# EAGLE design computeModuleDaughterV2 (EAGLE 9.5.2)

## Sheet 1 of 3
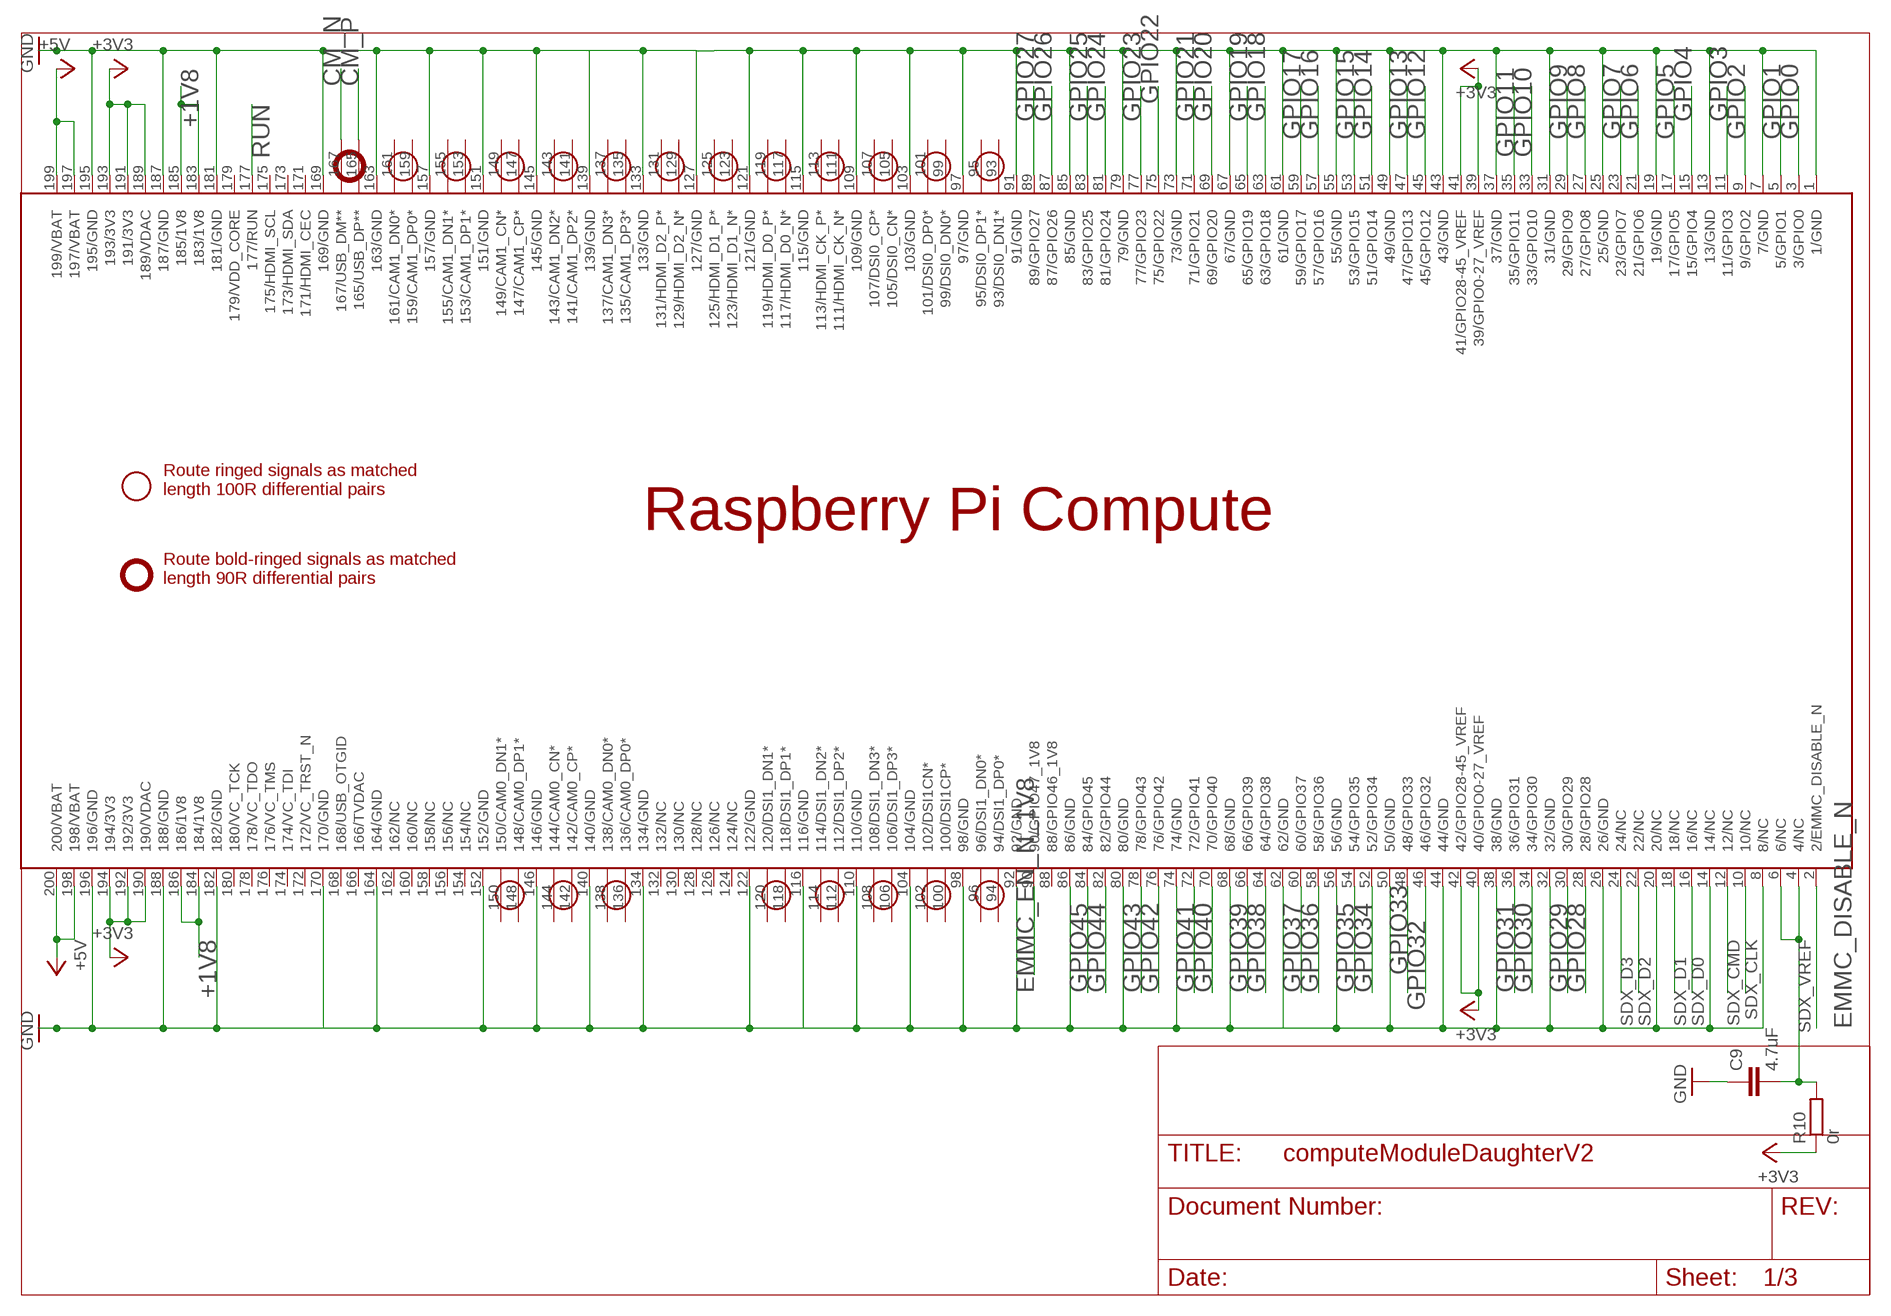
[diagram p0: schematic, sheet 1]

### Parts
C9  4.7uF  C-EUC0603  [C0603]
PCB1  RPI_COMPUTE  [RPI_COMPUTE]
R10  0r  R-EU_R0603  [R0603]

### Nets
+1V8: PCB1.183(183/1V8) PCB1.184(184/1V8) PCB1.185(185/1V8) PCB1.186(186/1V8) ; also sheet 3
+3V3: PCB1.39(39/GPIO0-27_VREF) PCB1.40(40/GPIO0-27_VREF) PCB1.41(41/GPIO28-45_VREF) PCB1.42(42/GPIO28-45_VREF) PCB1.189(189/VDAC) PCB1.190(190/VDAC) PCB1.191(191/3V3) PCB1.192(192/3V3) PCB1.193(193/3V3) PCB1.194(194/3V3) R10.1 ; also sheet 2,3
+5V: PCB1.197(197/VBAT) PCB1.198(198/VBAT) PCB1.199(199/VBAT) PCB1.200(200/VBAT) ; also sheet 2,3
CM_N [USB]: PCB1.167(167/USB_DM**) ; also sheet 3
CM_P [USB]: PCB1.165(165/USB_DP**) ; also sheet 3
EMMC_DISABLE_N: PCB1.2(2/EMMC_DISABLE_N) ; also sheet 3
EMMC_EN_N_1V8: PCB1.90(90/GPIO47_1V8) ; also sheet 3
GND: C9.1 PCB1.1(1/GND) PCB1.7(7/GND) PCB1.8(8/NC) PCB1.13(13/GND) PCB1.14(14/NC) PCB1.19(19/GND) PCB1.20(20/NC) PCB1.25(25/GND) PCB1.26(26/GND) PCB1.31(31/GND) PCB1.32(32/GND) PCB1.37(37/GND) PCB1.38(38/GND) PCB1.43(43/GND) PCB1.44(44/GND) PCB1.49(49/GND) PCB1.50(50/GND) PCB1.55(55/GND) PCB1.56(56/GND) PCB1.61(61/GND) PCB1.62(62/GND) PCB1.67(67/GND) PCB1.68(68/GND) PCB1.73(73/GND) PCB1.74(74/GND) PCB1.79(79/GND) PCB1.80(80/GND) PCB1.85(85/GND) PCB1.86(86/GND) PCB1.91(91/GND) PCB1.92(92/GND) PCB1.97(97/GND) PCB1.98(98/GND) PCB1.103(103/GND) PCB1.104(104/GND) PCB1.109(109/GND) PCB1.110(110/GND) PCB1.115(115/GND) PCB1.116(116/GND) PCB1.121(121/GND) PCB1.122(122/GND) PCB1.127(127/GND) PCB1.133(133/GND) PCB1.134(134/GND) PCB1.139(139/GND) PCB1.140(140/GND) PCB1.145(145/GND) PCB1.146(146/GND) PCB1.151(151/GND) PCB1.152(152/GND) PCB1.157(157/GND) PCB1.163(163/GND) PCB1.164(164/GND) PCB1.169(169/GND) PCB1.170(170/GND) PCB1.181(181/GND) PCB1.182(182/GND) PCB1.187(187/GND) PCB1.188(188/GND) PCB1.195(195/GND) PCB1.196(196/GND) ; also sheet 2,3
GPIO0: PCB1.3(3/GPIO0) ; also sheet 2
GPIO1: PCB1.5(5/GPIO1) ; also sheet 2
GPIO2: PCB1.9(9/GPIO2) ; also sheet 2
GPIO3: PCB1.11(11/GPIO3) ; also sheet 2
GPIO4: PCB1.15(15/GPIO4) ; also sheet 2
GPIO5: PCB1.17(17/GPIO5) ; also sheet 2
GPIO6: PCB1.21(21/GPIO6) ; also sheet 2
GPIO7: PCB1.23(23/GPIO7) ; also sheet 2
GPIO8: PCB1.27(27/GPIO8) ; also sheet 2
GPIO9: PCB1.29(29/GPIO9) ; also sheet 2
GPIO10: PCB1.33(33/GPIO10) ; also sheet 2
GPIO11: PCB1.35(35/GPIO11) ; also sheet 2
GPIO12: PCB1.45(45/GPIO12) ; also sheet 2
GPIO13: PCB1.47(47/GPIO13) ; also sheet 2
GPIO14: PCB1.51(51/GPIO14) ; also sheet 2
GPIO15: PCB1.53(53/GPIO15) ; also sheet 2
GPIO16: PCB1.57(57/GPIO16) ; also sheet 2
GPIO17: PCB1.59(59/GPIO17) ; also sheet 2
GPIO18: PCB1.63(63/GPIO18) ; also sheet 2
GPIO19: PCB1.65(65/GPIO19) ; also sheet 2
GPIO20: PCB1.69(69/GPIO20) ; also sheet 2
GPIO21: PCB1.71(71/GPIO21) ; also sheet 2
GPIO22: PCB1.75(75/GPIO22) ; also sheet 2
GPIO23: PCB1.77(77/GPIO23) ; also sheet 2
GPIO24: PCB1.81(81/GPIO24) ; also sheet 2
GPIO25: PCB1.83(83/GPIO25) ; also sheet 2
GPIO26: PCB1.87(87/GPIO26) ; also sheet 2
GPIO27: PCB1.89(89/GPIO27) ; also sheet 2
GPIO28: PCB1.28(28/GPIO28) ; also sheet 2
GPIO29: PCB1.30(30/GPIO29) ; also sheet 2
GPIO30: PCB1.34(34/GPIO30) ; also sheet 2
GPIO31: PCB1.36(36/GPIO31) ; also sheet 2
GPIO32: PCB1.46(46/GPIO32) ; also sheet 2
GPIO33: PCB1.48(48/GPIO33) ; also sheet 2
GPIO34: PCB1.52(52/GPIO34) ; also sheet 2
GPIO35: PCB1.54(54/GPIO35) ; also sheet 2
GPIO36: PCB1.58(58/GPIO36) ; also sheet 2
GPIO37: PCB1.60(60/GPIO37) ; also sheet 2
GPIO38: PCB1.64(64/GPIO38) ; also sheet 2
GPIO39: PCB1.66(66/GPIO39) ; also sheet 2
GPIO40: PCB1.70(70/GPIO40) ; also sheet 2
GPIO41: PCB1.72(72/GPIO41) ; also sheet 2
GPIO42: PCB1.76(76/GPIO42) ; also sheet 2
GPIO43: PCB1.78(78/GPIO43) ; also sheet 2
GPIO44: PCB1.82(82/GPIO44) ; also sheet 2
GPIO45: PCB1.84(84/GPIO45) ; also sheet 2
RUN: PCB1.177(177/RUN) ; also sheet 2
SDX_CLK: PCB1.10(10/NC) ; also sheet 2
SDX_CMD: PCB1.12(12/NC) ; also sheet 2
SDX_D0: PCB1.16(16/NC) ; also sheet 2
SDX_D1: PCB1.18(18/NC) ; also sheet 2
SDX_D2: PCB1.22(22/NC) ; also sheet 2
SDX_D3: PCB1.24(24/NC) ; also sheet 2
SDX_VREF: C9.2 PCB1.4(4/NC) PCB1.6(6/NC) R10.2
Unconnected: PCB1.88(88/GPIO46_1V8) PCB1.93(93/DSI0_DN1*) PCB1.94(94/DSI1_DP0*) PCB1.95(95/DSI0_DP1*) PCB1.96(96/DSI1_DN0*) PCB1.99(99/DSI0_DN0*) PCB1.100(100/DSI1CP*) PCB1.101(101/DSI0_DP0*) PCB1.102(102/DSI1CN*) PCB1.105(105/DSI0_CN*) PCB1.106(106/DSI1_DP3*) PCB1.107(107/DSI0_CP*) PCB1.108(108/DSI1_DN3*) PCB1.111(111/HDMI_CK_N*) PCB1.112(112/DSI1_DP2*) PCB1.113(113/HDMI_CK_P*) PCB1.114(114/DSI1_DN2*) PCB1.117(117/HDMI_D0_N*) PCB1.118(118/DSI1_DP1*) PCB1.119(119/HDMI_D0_P*) PCB1.120(120/DSI1_DN1*) PCB1.123(123/HDMI_D1_N*) PCB1.124(124/NC) PCB1.125(125/HDMI_D1_P*) PCB1.126(126/NC) PCB1.128(128/NC) PCB1.129(129/HDMI_D2_N*) PCB1.130(130/NC) PCB1.131(131/HDMI_D2_P*) PCB1.132(132/NC) PCB1.135(135/CAM1_DP3*) PCB1.136(136/CAM0_DP0*) PCB1.137(137/CAM1_DN3*) PCB1.138(138/CAM0_DN0*) PCB1.141(141/CAM1_DP2*) PCB1.142(142/CAM0_CP*) PCB1.143(143/CAM1_DN2*) PCB1.144(144/CAM0_CN*) PCB1.147(147/CAM1_CP*) PCB1.148(148/CAM0_DP1*) PCB1.149(149/CAM1_CN*) PCB1.150(150/CAM0_DN1*) PCB1.153(153/CAM1_DP1*) PCB1.154(154/NC) PCB1.155(155/CAM1_DN1*) PCB1.156(156/NC) PCB1.158(158/NC) PCB1.159(159/CAM1_DP0*) PCB1.160(160/NC) PCB1.161(161/CAM1_DN0*) PCB1.162(162/NC) PCB1.166(166/TVDAC) PCB1.168(168/USB_OTGID) PCB1.171(171/HDMI_CEC) PCB1.172(172/VC_TRST_N) PCB1.173(173/HDMI_SDA) PCB1.174(174/VC_TDI) PCB1.175(175/HDMI_SCL) PCB1.176(176/VC_TMS) PCB1.178(178/VC_TDO) PCB1.179(179/VDD_CORE) PCB1.180(180/VC_TCK)

## Sheet 2 of 3
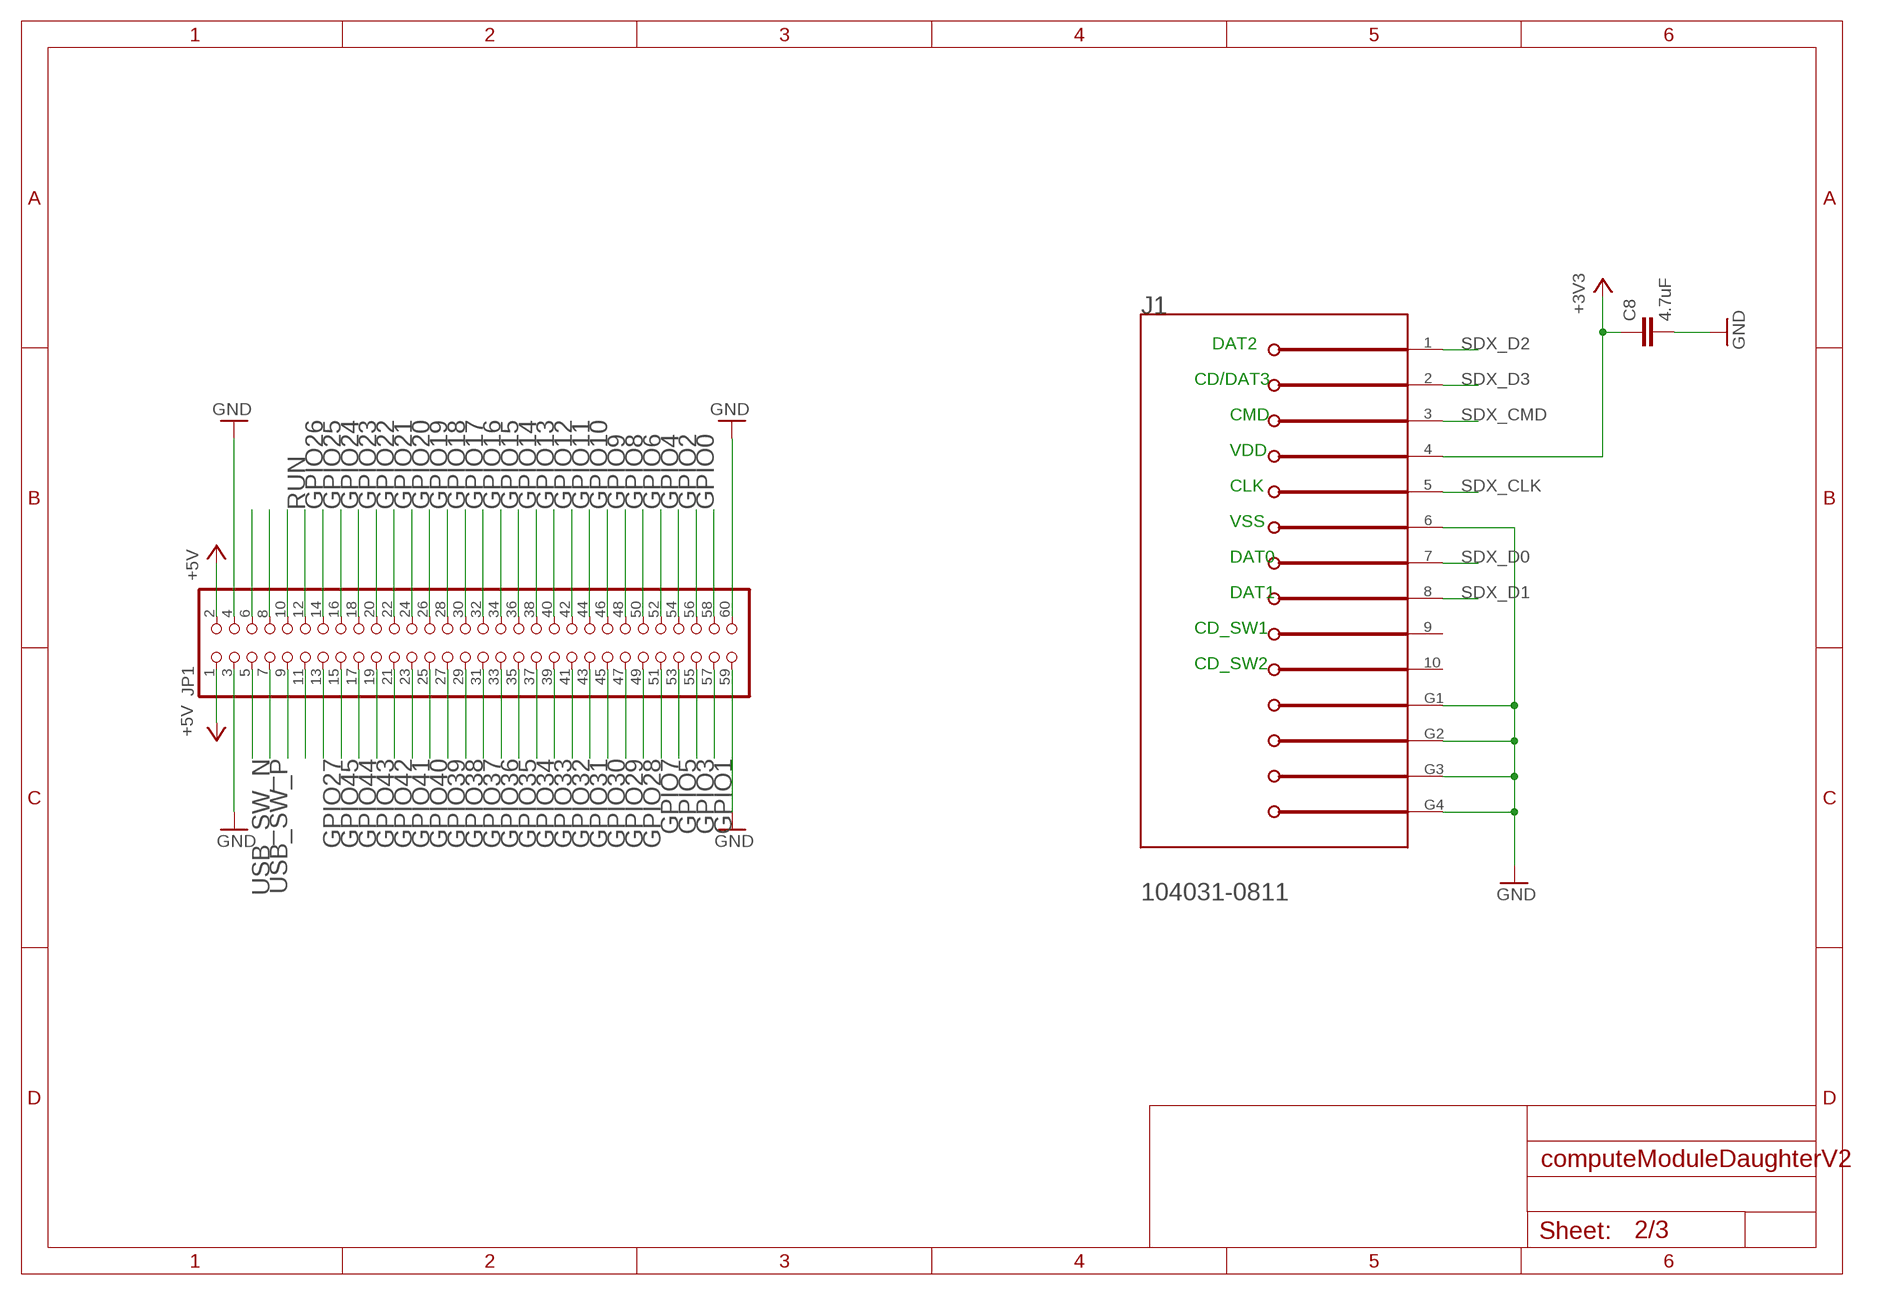
[diagram p1: schematic, sheet 2]

### Parts
C8  4.7uF  C-EUC0603  [C0603]
J1  MOLEX_104031-0811MOLEX_104031-0811_0_0  [MOLEX_104031-0811_0]
JP1  PINHD-2X30  [2X30]

### Nets
+3V3: C8.1 J1.4(VDD) ; also sheet 1,3
+5V: JP1.1 JP1.2 ; also sheet 1,3
GND: C8.2 J1.6(VSS) J1.G1 J1.G2 J1.G3 J1.G4 JP1.3 JP1.4 JP1.59 JP1.60 ; also sheet 1,3
GPIO0: JP1.58 ; also sheet 1
GPIO1: JP1.57 ; also sheet 1
GPIO2: JP1.56 ; also sheet 1
GPIO3: JP1.55 ; also sheet 1
GPIO4: JP1.54 ; also sheet 1
GPIO5: JP1.53 ; also sheet 1
GPIO6: JP1.52 ; also sheet 1
GPIO7: JP1.51 ; also sheet 1
GPIO8: JP1.50 ; also sheet 1
GPIO9: JP1.48 ; also sheet 1
GPIO10: JP1.46 ; also sheet 1
GPIO11: JP1.44 ; also sheet 1
GPIO12: JP1.42 ; also sheet 1
GPIO13: JP1.40 ; also sheet 1
GPIO14: JP1.38 ; also sheet 1
GPIO15: JP1.36 ; also sheet 1
GPIO16: JP1.34 ; also sheet 1
GPIO17: JP1.32 ; also sheet 1
GPIO18: JP1.30 ; also sheet 1
GPIO19: JP1.28 ; also sheet 1
GPIO20: JP1.26 ; also sheet 1
GPIO21: JP1.24 ; also sheet 1
GPIO22: JP1.22 ; also sheet 1
GPIO23: JP1.20 ; also sheet 1
GPIO24: JP1.18 ; also sheet 1
GPIO25: JP1.16 ; also sheet 1
GPIO26: JP1.14 ; also sheet 1
GPIO27: JP1.13 ; also sheet 1
GPIO28: JP1.49 ; also sheet 1
GPIO29: JP1.47 ; also sheet 1
GPIO30: JP1.45 ; also sheet 1
GPIO31: JP1.43 ; also sheet 1
GPIO32: JP1.41 ; also sheet 1
GPIO33: JP1.39 ; also sheet 1
GPIO34: JP1.37 ; also sheet 1
GPIO35: JP1.35 ; also sheet 1
GPIO36: JP1.33 ; also sheet 1
GPIO37: JP1.31 ; also sheet 1
GPIO38: JP1.29 ; also sheet 1
GPIO39: JP1.27 ; also sheet 1
GPIO40: JP1.25 ; also sheet 1
GPIO41: JP1.23 ; also sheet 1
GPIO42: JP1.21 ; also sheet 1
GPIO43: JP1.19 ; also sheet 1
GPIO44: JP1.17 ; also sheet 1
GPIO45: JP1.15 ; also sheet 1
N$77: JP1.10
N$78: JP1.8
N$79: JP1.6
N$82: JP1.9
N$83: JP1.11
RUN: JP1.12 ; also sheet 1
SDX_CLK: J1.5(CLK) ; also sheet 1
SDX_CMD: J1.3(CMD) ; also sheet 1
SDX_D0: J1.7(DAT0) ; also sheet 1
SDX_D1: J1.8(DAT1) ; also sheet 1
SDX_D2: J1.1(DAT2) ; also sheet 1
SDX_D3: J1.2(CD/DAT3) ; also sheet 1
USB_SW_N [USB]: JP1.5 ; also sheet 3
USB_SW_P [USB]: JP1.7 ; also sheet 3
Unconnected: J1.9(1_CARD_DETECT_SWITCH) J1.10(2_CARD_DETECT_SWITCH)

### Notes on the sheet
- DAT2
- CD/DAT3
- CMD
- VDD
- CLK
- VSS
- DAT0
- DAT1
- CD_SW1
- CD_SW2

## Sheet 3 of 3
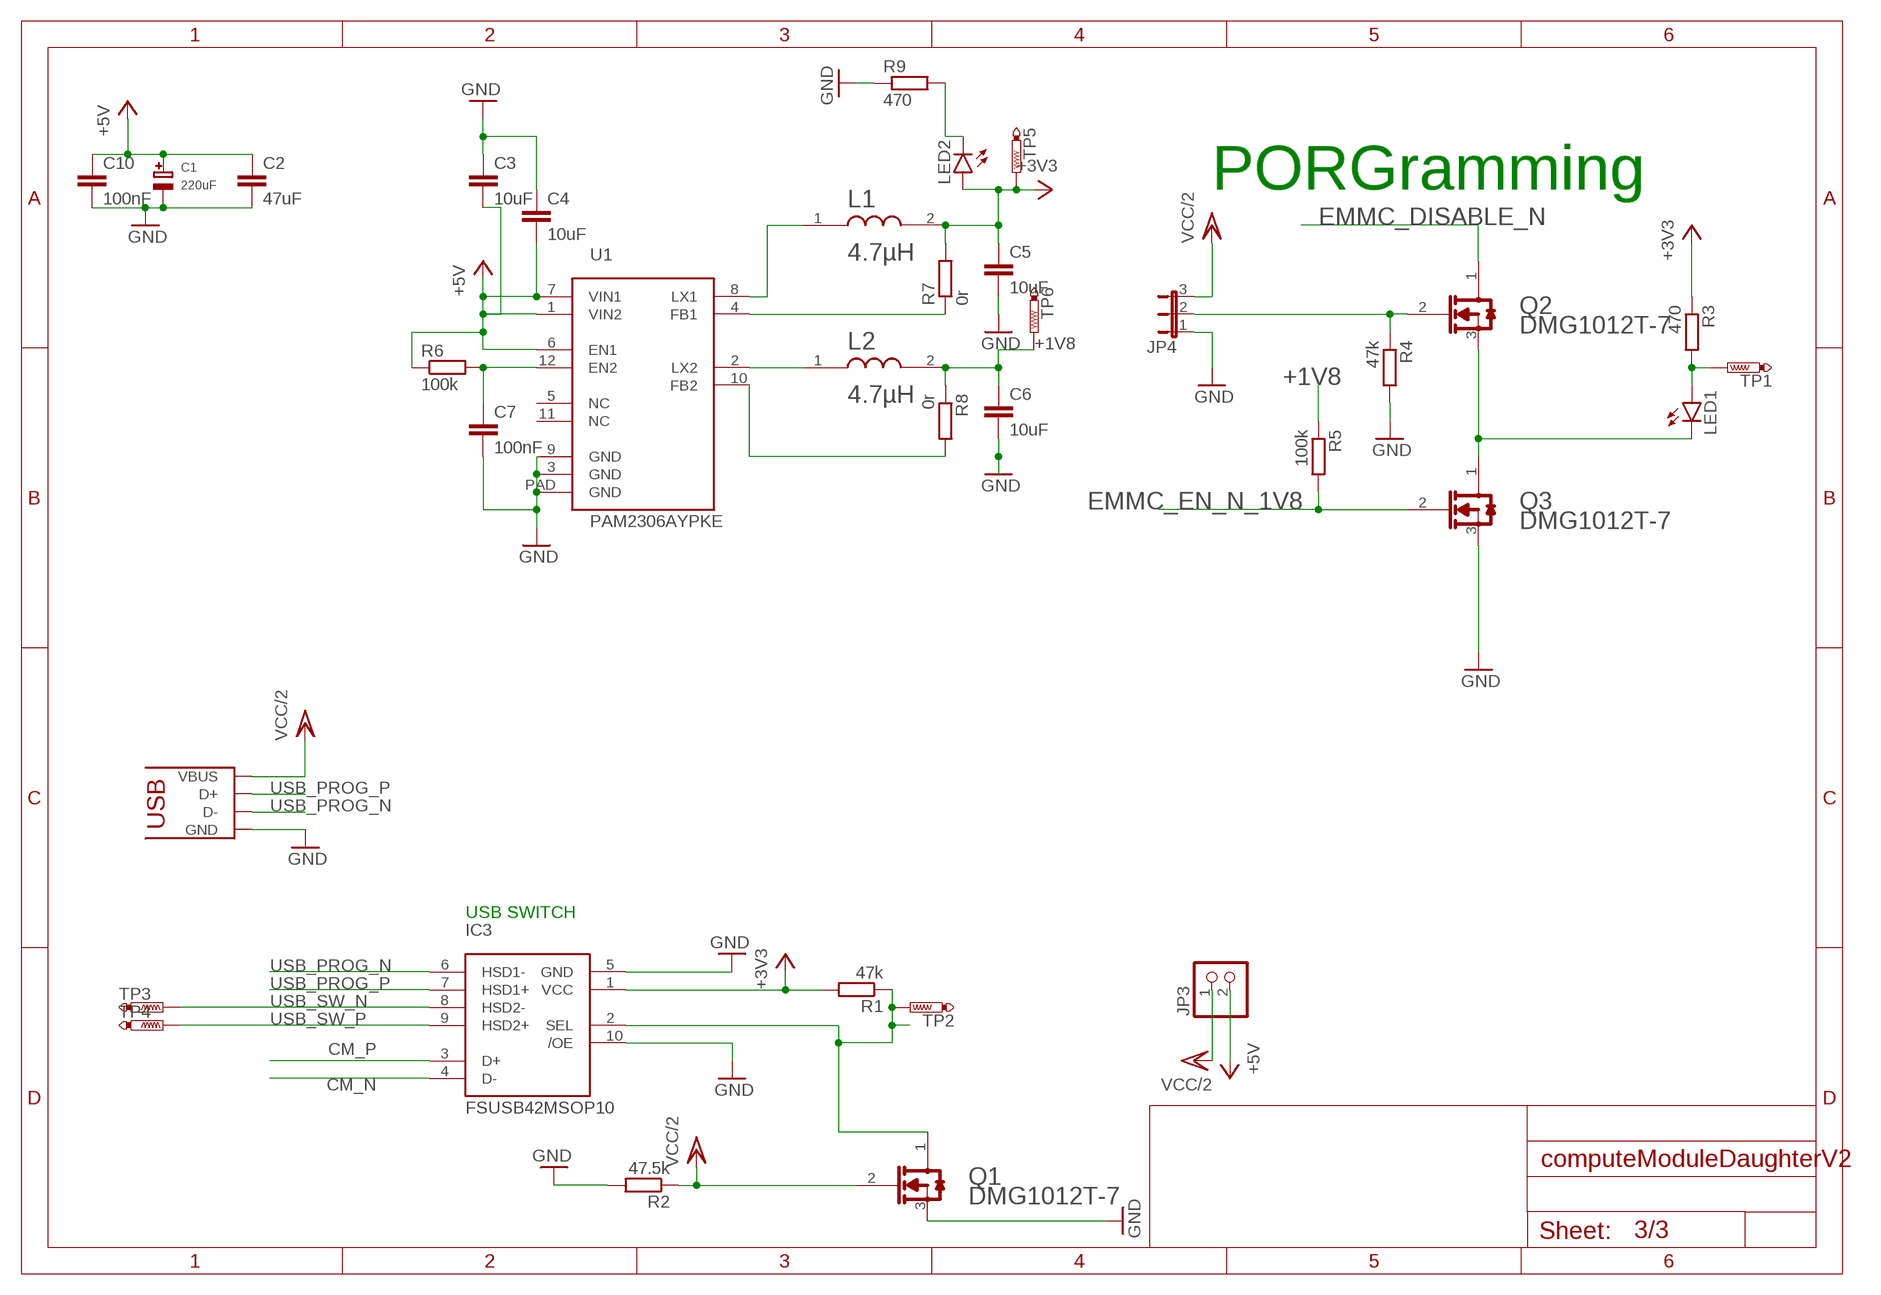
[diagram p2: schematic, sheet 3]

### Parts
C1  220uF  CAP_ELECTROLYTICPANASONIC_D  [PANASONIC_D]
C2  47uF  C-EUC1206  [C1206]
C3  10uF  C-EUC0805  [C0805]
C4  10uF  C-EUC0805  [C0805]
C5  10uF  C-EUC0805  [C0805]
C6  10uF  C-EUC0805  [C0805]
C7  100nF  C-EUC0603  [C0603]
C10  100nF  C-EUC0603  [C0603]
IC3  FSUSB42MSOP10  [MSOP10]
JP2  USB-MICROB  [USB-MICROB]
JP3  PINHD-1X2  [1X02]
JP4  JP2E  [JP2]
L1  BOURNS_SRN4018-4R7MBOURNS_SRN4018-4R7M_0_0  [BOURNS_SRN4018-4R7M_0]
L2  BOURNS_SRN4018-4R7MBOURNS_SRN4018-4R7M_0_0  [BOURNS_SRN4018-4R7M_0]
LED1  LEDCHIP-LED0603  [CHIP-LED0603]
LED2  LEDCHIP-LED0603  [CHIP-LED0603]
Q1  DIODES_DMG1012T-7DIODES_DMG1012T-7_0_0  [DIODES_DMG1012T-7_0]
Q2  DIODES_DMG1012T-7DIODES_DMG1012T-7_0_0  [DIODES_DMG1012T-7_0]
Q3  DIODES_DMG1012T-7DIODES_DMG1012T-7_0_0  [DIODES_DMG1012T-7_0]
R1  47k  R-EU_R0603  [R0603]
R2  47.5k  R-EU_R0603  [R0603]
R3  470  R-EU_R0603  [R0603]
R4  47k  R-EU_R0603  [R0603]
R5  100k  R-EU_R0603  [R0603]
R6  100k  R-EU_R0603  [R0603]
R7  0r  R-EU_R0603  [R0603]
R8  0r  R-EU_R0603  [R0603]
R9  470  R-EU_R0603  [R0603]
TP1  PTR1B1,27  [B1,27]
TP2  PTR1B1,27  [B1,27]
TP3  PTR1B1,27  [B1,27]
TP4  PTR1B1,27  [B1,27]
TP5  PTR1B1,27  [B1,27]
TP6  PTR1B1,27  [B1,27]
U1  PAM2306AYPKE  [WDFN-12L]

### Nets
+1V8: C6.1 L2.2 R5.1 R8.1 TP6.TP ; also sheet 1
+3V3: C5.1 IC3.1(VCC) L1.2 LED2.A R1.2 R3.1 R7.2 TP5.TP ; also sheet 1,2
+5V: C1.+ C2.1 C3.2 C4.2 C10.1 JP3.2 R6.1 U1.1(VIN2) U1.6(EN1) U1.7(VIN1) ; also sheet 1,2
CM_N [USB]: IC3.4(D-) ; also sheet 1
CM_P [USB]: IC3.3(D+) ; also sheet 1
EMMC_DISABLE_N: Q2.1(DRAIN) ; also sheet 1
EMMC_EN_N_1V8: Q3.2(GATE) R5.2 ; also sheet 1
GND: C1.- C2.2 C3.1 C4.1 C5.2 C6.2 C7.2 C10.2 IC3.5(GND) IC3.10(/OE) JP2.GND JP2.MT1(GND) JP2.MT2(GND) JP2.P$1(GND) JP2.P$2(GND) JP2.P$3(GND) JP2.P$4(GND) JP4.1 Q1.3(SOURCE) Q3.3(SOURCE) R2.2 R4.2 R9.1 U1.3(GND) U1.9(GND) U1.PAD(GND) ; also sheet 1,2
N$1: L1.1 U1.8(LX1)
N$2: JP4.2 Q2.2(GATE) R4.1
N$3: C7.1 R6.2 U1.12(EN2)
N$4: LED1.C Q2.3(SOURCE) Q3.1(DRAIN)
N$5: LED1.A R3.2 TP1.TP
N$6: L2.1 U1.2(LX2)
N$7: R7.1 U1.4(FB1)
N$8: IC3.2(SEL) Q1.1(DRAIN) R1.1 TP2.TP
N$9: LED2.C R9.2
N$11: R8.2 U1.10(FB2)
USB_PROG_N [USB]: IC3.6(HSD1-) JP2.D-
USB_PROG_P [USB]: IC3.7(HSD1+) JP2.D+
USB_SW_N [USB]: IC3.8(HSD2-) TP3.TP ; also sheet 2
USB_SW_P [USB]: IC3.9(HSD2+) TP4.TP ; also sheet 2
VCC/2: JP2.VBUS JP3.1 JP4.3 Q1.2(GATE) R2.1
Unconnected: U1.5(NC) U1.11(NC)

### Notes on the sheet
- PORGramming
- USB SWITCH

## Library data of the parts
C1 = microbuilder:CAP_ELECTROLYTIC: Electrolytic Capacitors SMT PANASONIC_C - Size C Panasonic Electrolytic Aluminum Capacitor 47µF 16V 20% Electrolytic Capacitor [Digikey: PCE3890TR-ND] PANASONIC_D - Size D Panasonic Electrolytic Aluminum Capacitor 100µF 25V 20% Electrolytic Capacitor [Digikey: PCE3898TR-ND] PTH 3.5 mm grid, 8 mm diameter ... 3.5 mm grid, 10 mm diameter ...
C2-C10 = resistor:C-EU: CAPACITOR, European symbol
IC3 = raspberrypi_cm:FSUSB42: FSUSB42 www.hasseb.fi
J1 = Molex - 104031-0811:MOLEX_104031-0811: 1.10mm Pitch microSD* Memory Card Connector, Surface Mount, Push-Pull Type, 1.42mm Height, with Detect Switch; CENTROID_NOT_SPECIFIED: No; CONN_GENDER: Female; CONN_ORIENTATION: Horizontal; CONTACT_MATERIAL: Gold; CURRENT_RATING: 0.5A; DATASHEET: http://www.molex.com/pdm_docs/sd/1040310811_sd.pdf; DEVICE_CLASS_L1: Connectors; DEVICE_CLASS_L2: Card Edge Connectors; DEVICE_CLASS_L3: unset; DIGIKEY_DESCRIPTION: CONN MICRO SD CARD PUSH-PULL R/A; DIGIKEY_PART_NUMBER: WM6357CT-ND; FOOTPRINT_URL: https://www.molex.com/pdm_docs/sd/1040310811_sd.pdf; HEIGHT: 1.57mm; IS_FEMALE: yes; LEAD_FREE: yes; MF: Molex; MFG_PACKAGE_IDENT: 104031-0811; MFG_PACKAGE_IDENT_DATE: 0; MFG_PACKAGE_IDENT_REV: 0; MOUSER_DESCRIPTION: 1.10mm Pitch microSD Memory Card Connector, SMT, Push-Pull Type, 1.42mm Height, with Detect Switch; MOUSER_PART_NUMBER: WM6357CT-ND; MPN: 104031-0811; NUMBER_OF_CONTACTS: 8; NUMBER_OF_ROWS: 1; PACKAGE: SMT_MICROSD_SOCKET; PREFIX: J; ROHS: yes; TEMPERATURE_RANGE_HIGH: +85°C; TEMPERATURE_RANGE_LOW: -25°C; VOLTAGE_RATING: 10mV
JP1 = pinhead:PINHD-2X30: PIN HEADER
JP2 = pimoroni:USB-MICROB
JP3 = pinhead:PINHD-1X2: PIN HEADER
JP4 = jumper:JP2E: JUMPER
L1 L2 = Bourns - SRN4018-4R7M:BOURNS_SRN4018-4R7M: Fixed Inductors 4.7uH 20% SMD 4018; CENTROID_NOT_SPECIFIED: No; DATASHEET: http://www.bourns.com/docs/Product-Datasheets/SRN4018.pdf; DCR_MAX: 0.084 Ohm; DIGIKEY_DESCRIPTION: IND 4.7µH Shielded Wirewound Inductor 1.9A 84 mOhm Max Nonstandard; DIGIKEY_PART_NUMBER: SRN4018-4R7MCT-ND; IMPORTED_FROM: octopart; INDUCTANCE: 4.7µH; IRMS: 1.9A; ISAT: 2A; LEAD_FREE: yes; MF: Bourns; MOUSER_PART_NUMBER: 652-SRN4018-4R7M; MPN: SRN4018-4R7M; NUM_PINS: 2; OCTOPART_PART_NUMBER: ed5a25d49750329d; PACKAGE: IND_SMD_4MM0_4MM0; PREFIX: L; ROHS: yes; TEMPERATURE_RANGE_HIGH: +120°C; TEMPERATURE_RANGE_LOW: -25°C; TOL.: 20%
LED1 LED2 = led:LED: LED OSRAM: - CHIPLED LG R971, LG N971, LY N971, LG Q971, LY Q971, LO R971, LY R971 LH N974, LH R974 LS Q976, LO Q976, LY Q976 LO Q996 - Hyper CHIPLED LW Q18S LB Q993, LB Q99A, LB R99A - SideLED LS A670, LO A670, LY A670, LG A670, LP A670 LB A673, LV A673, LT A673, LW A673 LH A674 LY A675 LS A676, LA A676, LO A676, LY A676, LW A676 LS A679, LY A679, LG A679 - Hyper Micro SIDELED® LS Y876, LA Y876, LO Y876, LY Y876 LT Y87S - SmartLED LW L88C, LW L88S LB L89C, LB L89S, LG L890 LS L89K, LO L89K, LY L89K LS L896, LA L896, LO L896, LY L896 - TOPLED LS T670, LO T670, LY T670, LG T670, LP T670 LSG T670, LSP T670, LSY T670, LOP T670, LYG T670 LG T671, LOG T671, LSG T671 LB T673, LV T673, LT T673, LW T673 LH T674 LS T676, LA T676, LO T676, LY T676, LB T676, LH T676, LSB T676, LW T676 LB T67C, LV T67C, LT T67C, LS T67K, LO T67K, LY T67K, LW E67C LS E67B, LA E67B, LO E67B, LY E67B, LB E67C, LV E67C, LT E67C LW T67C LS T679, LY T679, LG T679 LS T770, LO T770, LY T770, LG T770, LP T770 LB T773, LV T773, LT T773, LW T773 LH T774 LS E675, LA E675, LY E675, LS T675 LS T776, LA T776, LO T776, LY T776, LB T776 LHGB T686 LT T68C, LB T68C - Hyper Mini TOPLED® LB M676 - Mini TOPLED Santana® LG M470 LS M47K, LO M47K, LY M47K Source: http://www.osram.convergy.de LUXEON: - LUMILED® LXK2-PW12-R00, LXK2-PW12-S00, LXK2-PW14-U00, LXK2-PW14-V00 LXK2-PM12-R00, LXK2-PM12-S00, LXK2-PM14-U00 LXK2-PE12-Q00, LXK2-PE12-R00, LXK2-PE12-S00, LXK2-PE14-T00, LXK2-PE14-U00 LXK2-PB12-K00, LXK2-PB12-L00, LXK2-PB12-M00, LXK2-PB14-N00, LXK2-PB14-P00, LXK2-PB14-Q00 LXK2-PR12-L00, LXK2-PR12-M00, LXK2-PR14-Q00, LXK2-PR14-R00 LXK2-PD12-Q00, LXK2-PD12-R00, LXK2-PD12-S00 LXK2-PH12-R00, LXK2-PH12-S00 LXK2-PL12-P00, LXK2-PL12-Q00, LXK2-PL12-R00 Source: www.luxeon.com KINGBRIGHT: KA-3528ASYC Source: www.kingbright.com
PCB1 = e14_Rpi_Compute_RevC:RPI_COMPUTE: Device for a Raspberry PI Compute module. Note that the package is for a DDR2 connector of 'standard' orientation. Example: TE Connectivity P/N: 1565917-4, Newark P/N: 08P0616, Farnell P/N: 2112525 More information is available at http://www.element14.com/community/community/raspberry-pi/raspberry-pi-compute-module
Q1-Q3 = Diodes - DMG1012T-7:DIODES_DMG1012T-7: N-CHANNEL ENHANCEMENT MODE MOSFET; CENTROID_NOT_SPECIFIED: No; DATASHEET: https://www.diodes.com/assets/Datasheets/ds31783.pdf; DIGIKEY_DESCRIPTION: TRANS MOSFET N-CH 20V 630MA SOT-523; DIGIKEY_PART_NUMBER: DMG1012T-7DICT-ND; LEAD_FREE: yes; MF: Diodes; MOUSER_PART_NUMBER: 621-DMG1012T-7; MPN: DMG1012T-7; PACKAGE: SOT523; PREFIX: Q; ROHS: yes; TEMPERATURE_RANGE_HIGH: +150°C; TEMPERATURE_RANGE_LOW: -55°C
R1-R10 = resistor:R-EU_: RESISTOR, European symbol
TP1-TP6 = testpad:PTR1: TEST PIN
U1 = pimoroni-ics:PAM2306AYPKE

## Net classes
1 USB: width 0.178 mm

## Board
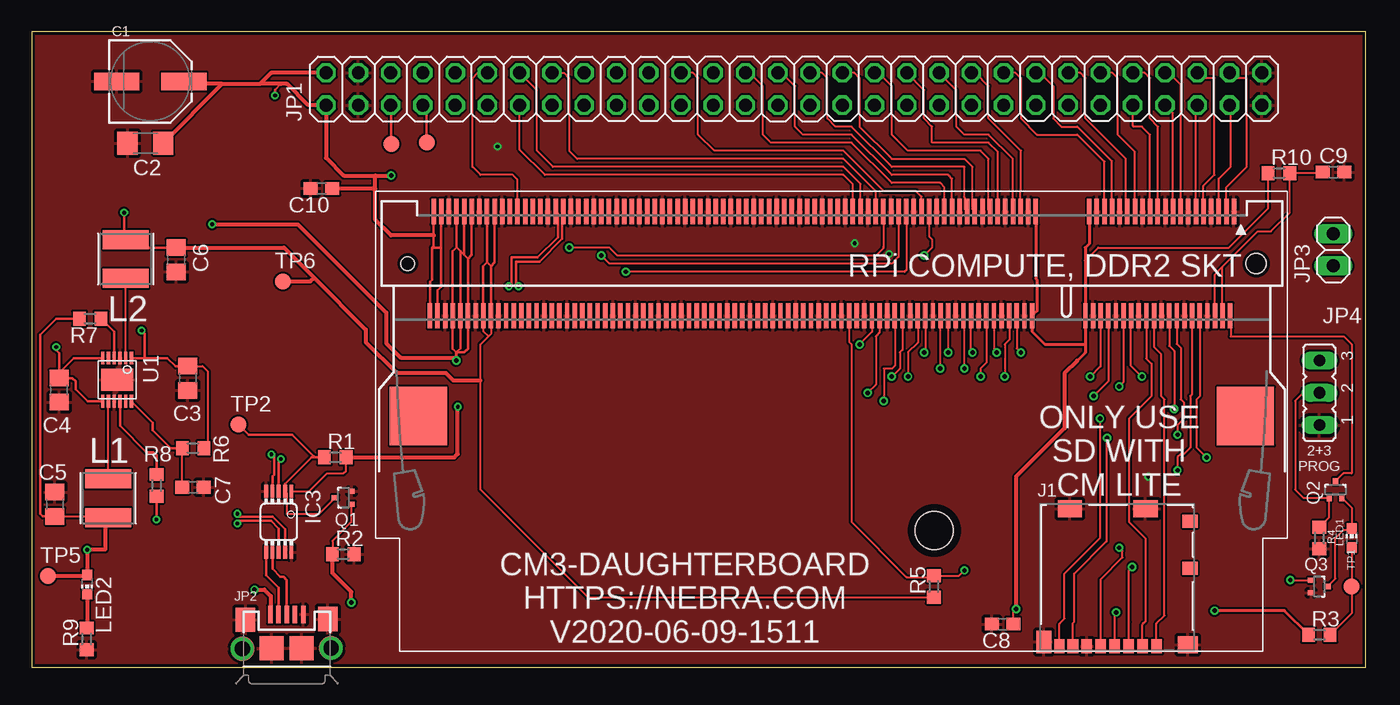
[diagram p3: board, top side]
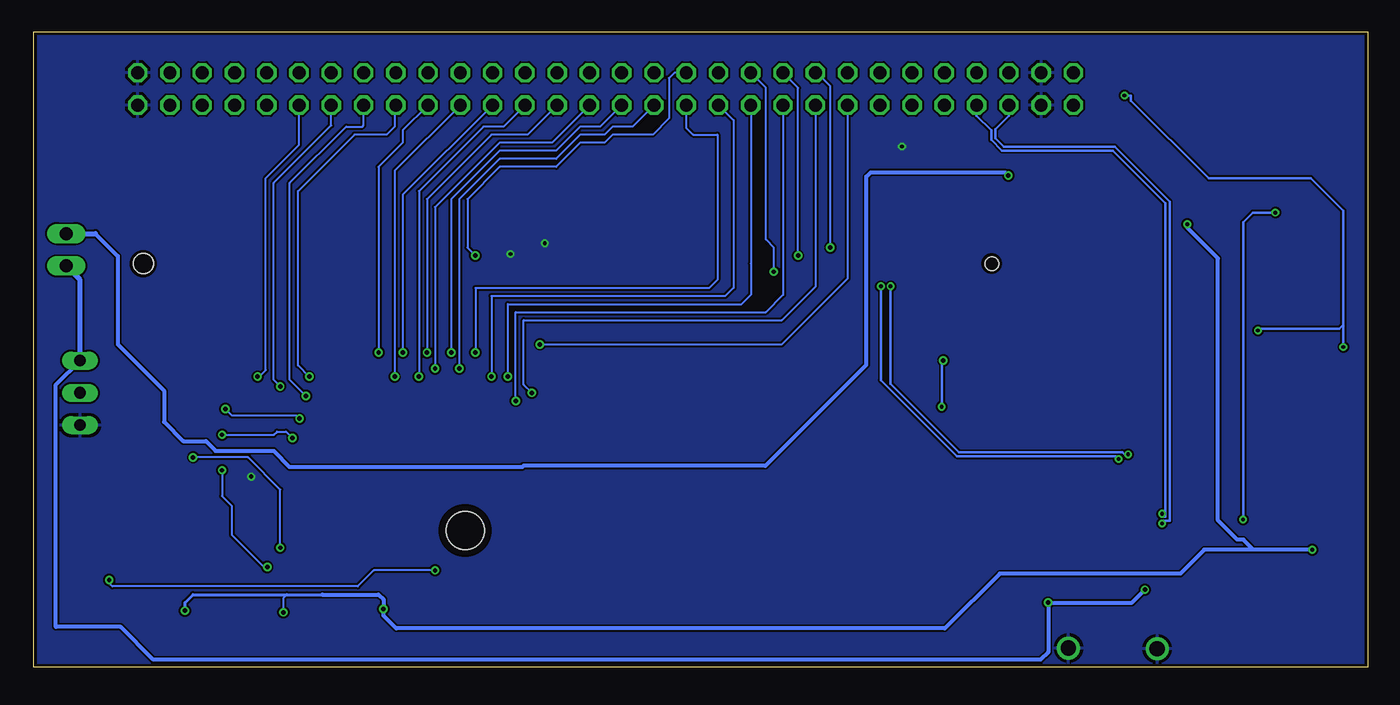
[diagram p4: board, bottom side, seen from below]

Size 105 x 50 mm. Coordinates in mm from the lower left corner, seen from the top.
Outline: 0,0 105,0 105,50 0,50 0,0
Copper layers (1*16): Top 0.035mm / dielectric 1.5mm / Bottom 0.035mm
Design rules "dirt_cheap_dirty_boards.v1.1": minimum track width 6mil, minimum drill 12mil, track to track 6mil, track to pad 6mil, pad to pad 6mil, via to via 6mil, smd to smd 0mil, copper to edge 10mil, drill to drill 10mil, minimum pad ring 10mil, minimum via ring 6mil, stop-mask expansion 2mil, vias tented up to drill 25mil, thermal gap 10mil
Holes 3 mm at 71.04,10.75
tRestrict: area 69,8.7 to 73.1,12.8
bRestrict: area 69,8.7 to 73.1,12.8

### Footprints (pad centres in the part's own frame; a part is rotated, then mirrored left to right if it is on the bottom)
PANASONIC_D = smd 3.556 x 1.4: + 2.654,0; - -2.654,0
C1206 = smd 1.6 x 1.8: 1 -1.4,0; 2 1.4,0
C0805 = smd 1.3 x 1.5: 1 -0.95,0; 2 0.95,0
C0603 = smd 1.1 x 1: 1 -0.85,0; 2 0.85,0
MSOP10 = smd 0.3 x 1.02: 1 -1,-2.4; 2 -0.5,-2.4; 3 0,-2.4; 4 0.5,-2.4; 5 1,-2.4; 6 1,2.4; 7 0.5,2.4; 8 0,2.4; 9 -0.5,2.4; 10 -1,2.4
MOLEX_104031-0811_0 = smd 0.85 x 1.1: 1 3.105,-5.45; 2 2.005,-5.45; 3 0.905,-5.45; 4 -0.195,-5.45; 5 -1.295,-5.45; 6 -2.395,-5.45; 7 -3.495,-5.45 | smd 0.75 x 1.1: 8 -4.545,-5.45 | smd 1.2 x 1: 9 5.74,4.4; 10 5.74,0.7 | smd 1.55 x 1.35: G1 5.565,-5.325 | smd 1.17 x 1.8: G2 -5.755,-5.1 | smd 1.9 x 1.35: G3 -3.73,5.375; G4 2.24,5.375
2X30 = drill 1.016 octagon: 1 -38.1,-1.27; 2 -38.1,1.27; 3 -35.56,-1.27; 4 -35.56,1.27; 5 -33.02,-1.27; 6 -33.02,1.27; 7 -30.48,-1.27; 8 -30.48,1.27; 9 -27.94,-1.27; 10 -27.94,1.27; 11 -25.4,-1.27; 12 -25.4,1.27; 13 -22.86,-1.27; 14 -22.86,1.27; 15 -20.32,-1.27; 16 -20.32,1.27; 17 -17.78,-1.27; 18 -17.78,1.27; 19 -15.24,-1.27; 20 -15.24,1.27; 21 -12.7,-1.27; 22 -12.7,1.27; 23 -10.16,-1.27; 24 -10.16,1.27; 25 -7.62,-1.27; 26 -7.62,1.27; 27 -5.08,-1.27; 28 -5.08,1.27; 29 -2.54,-1.27; 30 -2.54,1.27; 31 0,-1.27; 32 0,1.27; 33 2.54,-1.27; 34 2.54,1.27; 35 5.08,-1.27; 36 5.08,1.27; 37 7.62,-1.27; 38 7.62,1.27; 39 10.16,-1.27; 40 10.16,1.27; 41 12.7,-1.27; 42 12.7,1.27; 43 15.24,-1.27; 44 15.24,1.27; 45 17.78,-1.27; 46 17.78,1.27; 47 20.32,-1.27; 48 20.32,1.27; 49 22.86,-1.27; 50 22.86,1.27; 51 25.4,-1.27; 52 25.4,1.27; 53 27.94,-1.27; 54 27.94,1.27; 55 30.48,-1.27; 56 30.48,1.27; 57 33.02,-1.27; 58 33.02,1.27; 59 35.56,-1.27; 60 35.56,1.27
USB-MICROB = smd 0.35 x 1.4: D+ 0,2.65; D- -0.65,2.65; GND 1.3,2.65; ID 0.65,2.65; VBUS -1.3,2.65 | smd 1.546 x 1.9: MT1 -3.251,2.235; MT2 3.226,2.286 | smd 1.9 x 1.9: P$1 -1.194,0; P$2 1.168,0; P$5 -3.505,-0.051; P$6 3.48,0.025 | drill 1.2 pad 1.6: P$3 -3.505,-0.051; P$4 3.48,0
1X02 = drill 1.016 long: 1 -1.27,0; 2 1.27,0
JP2 = drill 0.914 long: 1 -2.54,0; 2 0,0; 3 2.54,0
BOURNS_SRN4018-4R7M_0 = smd 1.5 x 3.6: 1 -1.525,0; 2 1.525,0
CHIP-LED0603 = smd 0.8 x 0.8: A 0,-0.75; C 0,0.75
RPI_COMPUTE = smd 0.35 x 2: 1 -31.38,-4.1; 2 -31.08,4.1; 3 -30.78,-4.1; 4 -30.48,4.1; 5 -30.18,-4.1; 6 -29.88,4.1; 7 -29.58,-4.1; 8 -29.28,4.1; 9 -28.98,-4.1; 10 -28.68,4.1; 11 -28.38,-4.1; 12 -28.08,4.1; 13 -27.78,-4.1; 14 -27.48,4.1; 15 -27.18,-4.1; 16 -26.88,4.1; 17 -26.58,-4.1; 18 -26.28,4.1; 19 -25.98,-4.1; 20 -25.68,4.1; 21 -25.38,-4.1; 22 -25.08,4.1; 23 -24.78,-4.1; 24 -24.48,4.1; 25 -24.18,-4.1; 26 -23.88,4.1; 27 -23.58,-4.1; 28 -23.28,4.1; 29 -22.98,-4.1; 30 -22.68,4.1; 31 -22.38,-4.1; 32 -22.08,4.1; 33 -21.78,-4.1; 34 -21.48,4.1; 35 -21.18,-4.1; 36 -20.88,4.1; 37 -20.58,-4.1; 38 -20.28,4.1; 39 -19.98,-4.1; 40 -19.68,4.1; 41 -15.78,-4.1; 42 -15.48,4.1; 43 -15.18,-4.1; 44 -14.88,4.1; 45 -14.58,-4.1; 46 -14.28,4.1; 47 -13.98,-4.1; 48 -13.68,4.1; 49 -13.38,-4.1; 50 -13.08,4.1; 51 -12.78,-4.1; 52 -12.48,4.1; 53 -12.18,-4.1; 54 -11.88,4.1; 55 -11.58,-4.1; 56 -11.28,4.1; 57 -10.98,-4.1; 58 -10.68,4.1; 59 -10.38,-4.1; 60 -10.08,4.1; 61 -9.78,-4.1; 62 -9.48,4.1; 63 -9.18,-4.1; 64 -8.88,4.1; 65 -8.58,-4.1; 66 -8.28,4.1; 67 -7.98,-4.1; 68 -7.68,4.1; 69 -7.38,-4.1; 70 -7.08,4.1; 71 -6.78,-4.1; 72 -6.48,4.1; 73 -6.18,-4.1; 74 -5.88,4.1; 75 -5.58,-4.1; 76 -5.28,4.1; 77 -4.98,-4.1; 78 -4.68,4.1; 79 -4.38,-4.1; 80 -4.08,4.1; 81 -3.78,-4.1; 82 -3.48,4.1; 83 -3.18,-4.1; 84 -2.88,4.1; 85 -2.58,-4.1; 86 -2.28,4.1; 87 -1.98,-4.1; 88 -1.68,4.1; 89 -1.38,-4.1; 90 -1.08,4.1; 91 -0.78,-4.1; 92 -0.48,4.1; 93 -0.18,-4.1; 94 0.12,4.1; 95 0.42,-4.1; 96 0.72,4.1; 97 1.02,-4.1; 98 1.32,4.1; 99 1.62,-4.1; 100 1.92,4.1; 101 2.22,-4.1; 102 2.52,4.1; 103 2.82,-4.1; 104 3.12,4.1; 105 3.42,-4.1; 106 3.72,4.1; 107 4.02,-4.1; 108 4.32,4.1; 109 4.62,-4.1; 110 4.92,4.1; 111 5.22,-4.1; 112 5.52,4.1; 113 5.82,-4.1; 114 6.12,4.1; 115 6.42,-4.1; 116 6.72,4.1; 117 7.02,-4.1; 118 7.32,4.1; 119 7.62,-4.1; 120 7.92,4.1; 121 8.22,-4.1; 122 8.52,4.1; 123 8.82,-4.1; 124 9.12,4.1; 125 9.42,-4.1; 126 9.72,4.1; 127 10.02,-4.1; 128 10.32,4.1; 129 10.62,-4.1; 130 10.92,4.1; 131 11.22,-4.1; 132 11.52,4.1; 133 11.82,-4.1; 134 12.12,4.1; 135 12.42,-4.1; 136 12.72,4.1; 137 13.02,-4.1; 138 13.32,4.1; 139 13.62,-4.1; 140 13.92,4.1; 141 14.22,-4.1; 142 14.52,4.1; 143 14.82,-4.1; 144 15.12,4.1; 145 15.42,-4.1; 146 15.72,4.1; 147 16.02,-4.1; 148 16.32,4.1; 149 16.62,-4.1; 150 16.92,4.1; 151 17.22,-4.1; 152 17.52,4.1; 153 17.82,-4.1; 154 18.12,4.1; 155 18.42,-4.1; 156 18.72,4.1; 157 19.02,-4.1; 158 19.32,4.1; 159 19.62,-4.1; 160 19.92,4.1; 161 20.22,-4.1; 162 20.52,4.1; 163 20.82,-4.1; 164 21.12,4.1; 165 21.42,-4.1; 166 21.72,4.1; 167 22.02,-4.1; 168 22.32,4.1; 169 22.62,-4.1; 170 22.92,4.1; 171 23.22,-4.1; 172 23.52,4.1; 173 23.82,-4.1; 174 24.12,4.1; 175 24.42,-4.1; 176 24.72,4.1; 177 25.02,-4.1; 178 25.32,4.1; 179 25.62,-4.1; 180 25.92,4.1; 181 26.22,-4.1; 182 26.52,4.1; 183 26.82,-4.1; 184 27.12,4.1; 185 27.42,-4.1; 186 27.72,4.1; 187 28.02,-4.1; 188 28.32,4.1; 189 28.62,-4.1; 190 28.92,4.1; 191 29.22,-4.1; 192 29.52,4.1; 193 29.82,-4.1; 194 30.12,4.1; 195 30.42,-4.1; 196 30.72,4.1; 197 31.02,-4.1; 198 31.32,4.1; 199 31.62,-4.1; 200 31.92,4.1 | smd 4.5 x 4.6: M1 -32.28,12; M2 32.82,12 | hole 1.6: -33.13,0 | hole 1.1: 33.67,0
DIODES_DMG1012T-7_0 = smd 0.4 x 0.51: 1 0,0.65; 2 -0.5,-0.65; 3 0.5,-0.65
R0603 = smd 1 x 1.1: 1 -0.85,0; 2 0.85,0
B1,27 = smd 1.27 x 1.27: TP 0,0
WDFN-12L = smd 1 x 0.25: 1 -1.7,1.125; 2 -1.7,0.675; 3 -1.7,0.225; 4 -1.7,-0.225; 5 -1.7,-0.675; 6 -1.7,-1.125; 7 1.7,-1.125; 8 1.7,-0.675; 9 1.7,-0.225; 10 1.7,0.225; 11 1.7,0.675; 12 1.7,1.125 | smd 1.7 x 2.5: PAD 0,0

### Placement (x,y rotation side)
C1  9.33,46.09 0 top
C2  8.94,41.24 180 top
C3  12.29,22.73 90 top
C4  2.15,21.8 90 top
C5  1.82,12.82 90 top
C6  11.37,32.06 270 top
C7  12.7,14.16 0 top
C8  76.42,3.39 180 top
C9  102.48,38.96 180 top
C10  22.81,37.67 180 top
IC3  19.45,11.43 180 top
J1  85.44,7.08 0 top
JP1  61.27,45.5 0 top
JP2  20.08,1.5 0 top
JP3  102.45,32.85 90 top
JP4  101.36,21.59 90 top
L1  6.02,13.29 270 top
L2  7.39,32.12 90 top
LED1  103.9,10.16 0 top
LED2  4.36,6.5 180 top
PCB1  63.26,31.75 180 top
Q1  24.52,13.34 90 top
Q2  102.63,13.97 0 top
Q3  101.36,6.35 270 top
R1  23.89,16.51 0 top
R2  24.52,8.89 0 top
R3  101.36,2.54 0 top
R4  101.36,10.16 270 top
R5  71.01,6.35 90 top
R6  12.7,17.23 180 top
R7  4.6,27.42 180 top
R8  9.83,14.3 90 top
R9  4.32,2.22 90 top
R10  98.18,38.88 0 top
TP1  103.9,6.35 0 top
TP2  16.27,19.09 0 top
TP3  28.29,41.19 0 top
TP4  31.09,41.27 0 top
TP5  1.29,7.18 0 top
TP6  19.76,30.36 0 top
U1  6.72,22.62 270 top

### Tracks (layer width: path | path; a pad name or v marks a point on that pad's centre or on a via)
+1V8  (via drill 0.3)
  Top 0.152: PCB1.184 36.14,26.22 35.95,26.04 | 35.95,26.04 35.32,25.4 35.32,22.57 35.32,13.97 43.79,5.5 R5.1 | PCB1.186 35.54,26.45 35.95,26.04
  Top 0.203: PCB1.185 35.84,31.86 | PCB1.186 35.54,31.57 35.84,31.86 | PCB1.184 36.14,31.57 | 36.14,31.57 35.84,31.86 | PCB1.183 36.44,31.86 36.14,31.57 | R8.1 9.83,11.84 9.71,11.72 v9.82,11.62 | v7.27,35.77 7.27,33.77 L2.2 8.03,33.01 C6.1
  Top 0.305: C6.1 19.86,33.01 22.21,30.66 | 22.21,30.66 26.3,26.57 26.3,25.57 28.71,23.16 32.59,23.16 33.18,22.57 35.32,22.57 | TP6.TP 21.92,30.36 22.21,30.66
  Bottom 0.203: v9.82,11.62 9.82,34.99 9.04,35.77 v7.27,35.77
+3V3  (via drill 0.3, 0.35)
  Top 0.152: 25.16,16.93 R1.2 24.74,15.46 24.52,15.24 23.26,15.24 21.84,13.83 IC3.1 | C5.1 5.91,11.87 L1.2 | J1.4 85.25,4.21 v85.36,4.32 | C8.1 77.27,4.36 v77.48,4.57 | 82.94,32 83.96,33.02 94.25,33.02 97.33,36.1 R10.1
  Top 0.2: PCB1.194 33.14,25.04 33.41,24.77 | PCB1.192 33.74,25.09 33.41,24.77 | PCB1.190 34.34,25.05 34.05,24.77 33.41,24.77
  Top 0.203: PCB1.194 33.14,32.74 33.44,33.05 | 33.44,33.05 PCB1.193 | PCB1.192 33.74,32.74 | 33.74,32.74 33.44,33.05 | PCB1.190 34.34,32.15 | 34.34,32.15 34.04,32.45 | 34.04,32.45 33.74,32.74 | PCB1.189 34.64,32.45 34.34,32.15 | PCB1.191 34.04,32.45 | C5.1 0.86,11.87 0.67,12.06 0.67,26.16 1.93,27.42 R7.2
  Top 0.254: 33.41,24.77 33.41,24.36 v33.41,24.13 | 82.94,25.41 PCB1.40 82.94,32 82.94,33.02 83.24,33.31 PCB1.39 | 82.94,25.41 82.94,25.4 79.77,25.4 78.74,26.43 PCB1.42 79.14,28.05 79.14,30.48 79.04,30.57 PCB1.41 | 82.94,25.41 82.94,24.76 82.31,24.13 | R3.1 98.61,4.45 v93.11,4.45
  Top 0.305: L1.2 5.78,11.53 5.78,9.24 v4.37,9.24 LED2.A 4.29,7.18 TP5.TP | v14.2,34.85 20.95,34.85 27.91,27.89 27.91,25.49 29.04,24.36 33.41,24.36 | R1.2 33.26,16.51 33.54,16.79 v33.54,20.49 | 82.31,24.13 81.29,23.11 81.29,18.8 77.48,14.99 v77.48,4.57
  Bottom 0.152: v85.36,4.32 85.36,5.46 85.1,5.71
  Bottom 0.178: v33.41,24.13 33.54,24 v33.54,20.49
  Bottom 0.254: 82.31,5.71 85.1,5.71 92.47,5.71 93.11,5.08 v93.11,4.45
  Bottom 0.305: v4.37,9.24 9,9.24 | v14.2,34.85 14.2,34.57 11.79,32.16 11.79,11.55 10.27,10.03 9.79,10.03 9,9.24 | 82.31,5.71 77.87,5.71 77.48,5.33 v77.48,4.57 77.48,4.06 76.47,3.05 33.29,3.05 28.97,7.37 23.89,7.37 | 9,9.24 12.87,9.24 14.75,7.37 23.89,7.37 | 23.89,7.37
+5V  (via drill 0.3, 0.35)
  Top 0.152: C3.2 13.45,23.68 13.85,23.28 13.85,17.53 R6.1
  Top 0.2: U1.1 8.89,24.32 | 8.89,24.32 10.68,24.32 11.32,23.68 C3.2 | v8.64,26.49 8.89,26.24 8.89,24.32
  Top 0.203: PCB1.197 32.24,33.02 | 32.24,33.02 32.24,29.94 31.94,29.64 PCB1.198 | PCB1.200 31.34,30.31 31.51,30.48 31.51,33.02 | 31.51,33.02 32.24,33.02 | 31.51,33.02 31.64,33.15 31.64,33.97 PCB1.199 | U1.6 3.3,24.32 2.15,23.17 C4.2 | U1.7 4.4,20.92 3.47,21.85 3.47,22.48 3.2,22.75 C4.2 | C4.2 2.15,24.7 1.92,24.93 v1.92,25.19 | v19.15,44.98 19.15,45.44 19.6,45.89
  Top 0.305: JP1.2 18.85,46.77 17.97,45.89 | 17.97,45.89 19.6,45.89 20.1,45.89 21.76,44.23 JP1.1 23.17,40.07 24.55,38.69 27.03,38.69 | 27.03,38.69 v28.29,38.69 | 31.64,33.97 28.28,33.97 27.03,35.22 27.03,37.62 | 27.03,37.62 27.03,38.69 | C10.1 26.98,37.67 27.03,37.62 | C2.1 14.99,45.89 | 14.99,45.89 17.97,45.89 | 14.99,45.89 12.18,45.89 C1.+
  Bottom 0.2: 1.92,26.95 2.25,26.62 8.56,26.62 8.64,26.54 v8.64,26.49
  Bottom 0.203: v1.92,25.19 1.92,26.95 1.92,35.9 4.48,38.46 12.53,38.46 18.63,44.56 18.63,44.98 v19.15,44.98
  Bottom 0.254: 28.55,38.94 v28.29,38.69
  Bottom 0.305: 100.17,34.12 98.39,32.34 98.39,25.4 94.76,21.77 94.76,19.3 93.23,17.78 91.45,17.78 90.69,17.02 86.12,17.02 84.85,15.75 66.56,15.75 66.48,15.83 47.42,15.83 39.47,23.79 39.47,38.6 39.13,38.94 28.55,38.94
  Bottom 0.406: JP3.2 100.17,34.12
CM_N  (via drill 0.3)
  Top 0.178: PCB1.167 41.42,35.67 41.42,33.85 39.82,32.25 37.78,32.25 37.78,29.97 v37.56,29.97 | v18.87,16.74 19.07,16.66 19.07,15.15 18.95,15.03 IC3.4
  Bottom 0.178: v37.56,29.97 37.56,22.29 32.2,16.93 19.33,16.93 19.07,16.66 v18.87,16.74
CM_P  (via drill 0.3)
  Top 0.178: PCB1.165 41.75,35.76 41.75,33.71 39.96,31.92 38.11,31.92 38.11,29.97 v38.32,29.97 | v19.61,16.38 19.45,16.21 IC3.3
  Bottom 0.178: v38.32,29.97 38.32,22.58 32.34,16.6 19.83,16.6 v19.61,16.38
EMMC_DISABLE_N
  Top 0.152: PCB1.2 94.38,27.61 94.38,26.04 103.27,26.04 103.9,25.4 103.9,15.24 103.25,15.24 Q2.1
EMMC_EN_N_1V8  (via drill 0.35)
  Top 0.152: PCB1.90 64.34,25.59 64.53,25.4 64.53,11.43 68.87,7.09 70.9,7.09 R5.2 73,7.2 v73.42,7.62 | v99.07,6.86 Q3.2
  Bottom 0.152: v73.42,7.62 78.25,7.62 79.52,6.35 98.82,6.35 99.07,6.6 v99.07,6.86
GND  (via drill 0.3, 0.35)
  other vias: 64.78,33.36 67.49,32.51 36.67,40.97 87.9,14.99
  pour Top: -9.12,0 -9.12,52.07 105.17,52.07 107.71,0 103.9,-3.81 -5.31,-3.81
  pour Bottom: -8.36,2.53 -8.36,51.31 105.17,51.31 107.71,-0.76 103.9,-4.57 -1.26,-4.57
GPIO0
  Top 0.152: PCB1.3 94.04,37.77 95.64,39.37 95.64,46.35 94.7,46.35 JP1.58
GPIO1
  Top 0.152: PCB1.5 93.44,38.44 94.38,39.37 94.38,44.15 JP1.57
GPIO2
  Top 0.152: PCB1.9 92.24,37.87 93.11,38.73 93.11,46.35 92.17,46.35 JP1.56
GPIO3
  Top 0.152: PCB1.11 91.64,44.12 JP1.55
GPIO4
  Top 0.152: PCB1.15 90.44,45.84 89.52,46.77 JP1.54
GPIO5
  Top 0.152: PCB1.17 89.84,43.6 JP1.53
GPIO6
  Top 0.152: PCB1.21 88.64,42.52 88.66,42.55 88.03,43.18 88.03,46.35 87.61,46.77 JP1.52
GPIO7
  Top 0.152: PCB1.23 88.03,35.87 88.03,41.91 87.39,42.55 86.75,42.55 86.67,42.63 JP1.51
GPIO8
  Top 0.152: PCB1.27 86.84,40.55 85.48,41.91 85.48,46.35 85.07,46.77 JP1.50
GPIO9
  Top 0.152: PCB1.29 86.12,35.97 86.12,40.01 82.94,43.18 82.94,46.35 82.53,46.77 JP1.48
GPIO10
  Top 0.152: PCB1.33 85.04,39.81 82.31,42.55 81.04,42.55 80.41,43.18 80.41,45.72 79.36,46.77 JP1.46
GPIO11
  Top 0.152: PCB1.35 84.44,39.78 82.31,41.91 79.14,41.91 77.87,43.18 77.87,46.35 77.45,46.77 JP1.44
GPIO12
  Top 0.152: PCB1.45 77.84,37.44 77.87,37.47 77.87,40.64 75.33,43.18 75.33,45.72 74.28,46.77 JP1.42
GPIO13
  Top 0.152: PCB1.47 77.23,40.01 75.33,41.91 73.42,41.91 72.78,42.55 72.78,45.41 JP1.40
GPIO14
  Top 0.152: PCB1.51 76.04,40.56 75.33,41.27 70.88,41.27 70.88,42.55 70.25,43.18 70.25,45.41 JP1.38
GPIO15
  Top 0.152: PCB1.53 75.33,35.97 75.33,40.01 74.69,40.64 68.97,40.64 67.7,41.91 67.7,45.72 66.66,46.77 JP1.36
GPIO16
  Top 0.152: PCB1.57 74.06,36.03 74.06,39.37 73.42,40.01 67.7,40.01 65.16,42.55 65.16,46.35 64.75,46.77 JP1.34
GPIO17
  Top 0.152: PCB1.59 73.44,36.05 73.44,36.95 73.42,36.97 73.42,39.37 67.7,39.37 64.53,42.55 63.26,42.55 62.62,43.18 62.62,46.35 62.21,46.77 JP1.32
GPIO18
  Top 0.152: PCB1.63 72.44,38.45 72.15,38.73 67.7,38.73 64.53,41.91 60.72,41.91 60.09,42.55 60.09,45.72 59.03,46.77 JP1.30
GPIO19
  Top 0.152: PCB1.65 71.84,37.77 71.52,38.1 67.7,38.1 64.53,41.27 58.18,41.27 57.55,41.91 57.55,45.72 56.49,46.77 JP1.28
GPIO20  (via drill 0.35)
  Top 0.152: v70.25,32.38 70.88,33.02 70.88,33.66 70.64,33.9 PCB1.69
  Bottom 0.152: JP1.26 54.59,46.77 55.01,46.35 55.01,43.18 56.27,41.91 59.45,41.91 60.09,41.27 61.99,41.27 63.9,39.37 68.34,39.37 70.88,36.83 70.88,33.02 v70.25,32.38
GPIO21
  Top 0.152: PCB1.71 70.04,37.03 69.61,37.47 67.07,37.47 63.9,40.64 53.73,40.64 52.47,41.91 52.47,46.35 52.05,46.77 JP1.24
GPIO22  (via drill 0.35)
  Top 0.152: PCB1.75 68.84,31.25 68.7,31.11 v46.75,31.11
  Bottom 0.152: JP1.22 47.38,45.59 47.38,33.66 46.75,33.02 v46.75,31.11
GPIO23  (via drill 0.35)
  Top 0.152: PCB1.77 68.24,32.28 67.7,31.75 45.48,31.75 v44.84,32.38
  Bottom 0.152: v44.84,32.38 44.84,45.59 JP1.20
GPIO24  (via drill 0.35)
  Top 0.152: PCB1.81 67.04,33.05 67.07,33.02 66.44,32.38 46.11,32.38 45.48,33.02 v42.3,33.02
  Bottom 0.152: v42.3,33.02 42.3,45.72 43.36,46.77 JP1.18
GPIO25
  Top 0.152: PCB1.83 66.44,37.46 63.9,40.01 42.94,40.01 42.3,40.64 42.3,46.35 41.89,46.77 JP1.16
GPIO26
  Top 0.152: PCB1.87 65.24,38.02 63.9,39.37 41.03,39.37 39.77,40.64 39.77,45.41 JP1.14
GPIO27
  Top 0.152: PCB1.89 64.64,37.99 63.9,38.73 40.4,38.73 38.41,40.73 JP1.13
GPIO28  (via drill 0.35)
  Top 0.152: v87.39,22.86 86.54,23.71 PCB1.28
  Bottom 0.152: JP1.49 84.13,41.11 86.75,38.48 86.75,23.37 87.26,22.86 v87.39,22.86
GPIO29  (via drill 0.35)
  Top 0.152: v85.61,22.1 85.94,22.43 PCB1.30
  Bottom 0.152: JP1.47 81.59,42.63 86.12,38.1 86.12,22.61 v85.61,22.1
GPIO30  (via drill 0.35)
  Top 0.152: v83.58,21.34 84.74,22.5 PCB1.34
  Bottom 0.152: JP1.45 79.05,42.63 79.14,42.55 80.41,42.55 84.85,38.1 84.85,22.61 v83.58,21.34
GPIO31  (via drill 0.35)
  Top 0.152: PCB1.36 84.14,23.67 v83.33,22.86
  Bottom 0.152: JP1.43 76.59,44.15 76.59,42.55 77.23,41.91 79.77,41.91 84.22,37.47 84.22,23.75 v83.33,22.86
GPIO32  (via drill 0.35)
  Top 0.152: PCB1.46 77.54,25.09 v77.87,24.77
  Bottom 0.152: JP1.41 75.96,42.24 75.96,41.27 77.87,39.37 v77.87,24.77
GPIO33  (via drill 0.35)
  Top 0.152: PCB1.48 76.94,25.75 76.59,25.4 v76.59,22.86
  Bottom 0.152: JP1.39 76.59,39.06 v76.59,22.86
GPIO34  (via drill 0.35)
  Top 0.152: PCB1.52 75.74,24.98 v75.96,24.77
  Bottom 0.152: JP1.37 75.96,37.16 v75.96,24.77
GPIO35  (via drill 0.35)
  Top 0.152: v74.69,22.86 74.69,23.5 75.14,23.95 PCB1.54
  Bottom 0.152: JP1.35 68.03,42.55 69.61,42.55 74.69,37.47 v74.69,22.86
GPIO36  (via drill 0.35)
  Top 0.152: v74.06,24.77 73.94,24.88 PCB1.58
  Bottom 0.152: JP1.33 66.13,41.91 68.97,41.91 74.06,36.83 v74.06,24.77
GPIO37  (via drill 0.35)
  Top 0.152: v73.42,23.5 73.42,27.57 PCB1.60
  Bottom 0.152: JP1.31 64.22,41.27 68.34,41.27 73.42,36.2 v73.42,23.5
GPIO38  (via drill 0.35)
  Top 0.152: v72.15,24.77 v72.14,24.77 PCB1.64
  Bottom 0.152: JP1.29 60.41,42.55 61.99,42.55 63.9,40.64 68.34,40.64 72.15,36.83 v72.15,24.77
GPIO39  (via drill 0.35)
  Top 0.152: v71.52,23.5 71.54,23.52 PCB1.66
  Bottom 0.152: JP1.27 57.88,42.55 59.45,42.55 60.09,41.91 61.99,41.91 63.9,40.01 68.34,40.01 71.52,36.83 v71.52,23.5
GPIO40  (via drill 0.35)
  Top 0.152: PCB1.70 70.34,24.86 v70.25,24.77
  Bottom 0.152: JP1.25 53.65,42.46 53.1,41.91 51.2,41.91 51.2,30.48 51.83,29.84 70.25,29.84 v70.25,24.77
GPIO41  (via drill 0.35)
  Top 0.152: PCB1.72 69.74,25.53 68.97,24.77 v68.97,22.86
  Bottom 0.152: JP1.23 49.92,43.05 49.92,29.84 50.56,29.21 68.97,29.21 v68.97,22.86
GPIO42  (via drill 0.35)
  Top 0.152: PCB1.76 68.54,24.96 68.34,24.77 68.34,23.5 v67.7,22.86
  Bottom 0.152: JP1.21 48.57,31.75 | 48.57,31.75 48.57,29.3 49.29,28.57 67.7,28.57 v67.7,22.86 | 48.57,31.75
GPIO43  (via drill 0.35)
  Top 0.152: PCB1.78 67.94,23.73 67.7,23.5 67.07,23.5 v67.07,20.95
  Bottom 0.152: JP1.19 46.03,29.3 47.38,27.94 67.07,27.94 v67.07,20.95
GPIO44  (via drill 0.35)
  Top 0.152: PCB1.82 66.74,26.34 66.44,26.04 66.44,22.23 v65.8,21.59
  Bottom 0.152: JP1.17 43.49,29.93 46.11,27.3 66.44,27.3 66.44,22.23 v65.8,21.59
GPIO45  (via drill 0.35)
  Top 0.152: PCB1.84 66.14,26.38 v65.16,25.4
  Bottom 0.152: JP1.15 40.95,30.57 46.11,25.4 v65.16,25.4
N$1
  Top 0.152: L1.1 6.02,20.89 U1.8
N$2
  Top 0.152: JP4.2 100.09,21.59 99.45,20.95 99.45,13.97 100.11,13.32 Q2.2 102.13,11.78 R4.1
N$3
  Top 0.152: C7.1 R6.2
  Top 0.203: U1.12 9.52,19.25 9.52,18.63 10.92,17.23 R6.2
N$4
  Top 0.152: Q2.3 103.9,12.55 LED1.C 103.78,10.79 103.27,10.79 102.63,10.16 102.63,6.97 Q3.1
N$5
  Top 0.152: LED1.A TP1.TP 103.9,4.23 R3.2
N$6
  Top 0.152: U1.2 L2.1
N$7
  Top 0.203: U1.4 6.49,26.38 R7.1
N$8
  Top 0.152: IC3.2 20.07,13.71 20.07,13.22 20.08,13.21 20.08,12.06 22.61,12.06 Q1.1
  Top 0.178: IC3.2 19.95,14.43 22.03,16.51 22.2,16.51 | 22.2,16.51 R1.1 | TP2.TP 17.08,18.29 20.5,18.29 22.2,16.59 22.2,16.51
N$9
  Top 0.305: LED2.C 4.36,3.11 R9.2
N$11
  Top 0.203: U1.10 6.95,19 9.01,16.93 9.57,16.93 9.83,16.67 R8.2
RUN
  Top 0.152: PCB1.177 38.24,38.35 37.86,38.73 35.32,38.73 34.69,39.37 34.69,46.35 35.1,46.77 JP1.12
SDX_CLK  (via drill 0.35)
  Top 0.152: J1.5 84.14,6.92 85.87,8.64 85.87,9.14 v85.61,9.4 | PCB1.10 91.94,21.31 91.71,21.08 91.71,17.27 v92.47,16.51
  Bottom 0.152: v85.61,9.4 85.61,13.97 88.15,16.51 v92.47,16.51
SDX_CMD  (via drill 0.35)
  Top 0.152: J1.3 86.34,3.53 86.37,3.56 86.37,7.62 v86.63,7.87 | PCB1.12 91.34,21.48 91.2,21.34 91.2,17.27 90.69,16.76 90.44,16.76 90.18,16.51 v90.18,15.49
  Bottom 0.152: v90.18,15.49 90.18,13.46 89.42,12.7 89.42,10.41 86.88,7.87 v86.63,7.87
SDX_D0  (via drill 0.35)
  Top 0.152: PCB1.16 90.14,25.44 90.44,25.15 90.44,21.08 90.69,20.83 90.69,19.56 90.18,19.05 v90.18,18.29 | J1.7 81.94,3.44 82.06,3.56 82.06,7.37 84.6,9.91 84.6,18.03 v84.64,18.03
  Bottom 0.152: v90.18,18.29 86.12,18.29 85.87,18.54 85.15,18.54 v84.64,18.03
SDX_D1  (via drill 0.35)
  Top 0.152: PCB1.18 89.54,25.28 89.93,24.89 v89.93,20.32 | J1.8 80.89,3.41 81.29,3.81 81.29,7.37 84.09,10.16 v84.09,19.56
  Bottom 0.152: v89.93,20.32 89.42,19.81 84.34,19.81 v84.09,19.56
SDX_D2
  Top 0.152: PCB1.22 88.34,25.21 88.91,24.64 88.91,21.34 89.17,21.08 89.17,4.06 88.55,3.44 J1.1
SDX_D3
  Top 0.152: PCB1.24 87.74,24.29 88.15,23.88 88.15,21.34 86.37,19.56 86.37,11.43 87.64,10.16 87.64,3.56 87.44,3.36 J1.2
SDX_VREF
  Top 0.152: PCB1.4 93.74,31.5 | 93.74,31.5 96.53,34.29 97.55,34.29 99.03,35.77 R10.2 101.55,38.88 C9.2 | PCB1.6 93.14,30.9 93.74,31.5
USB_PROG_N
  Top 0.178: IC3.6 18.45,7.22 19.43,6.24 JP2.D-
USB_PROG_P
  Top 0.178: IC3.7 18.95,7.74 19.57,7.11 19.83,7.11 20.08,6.86 JP2.D+
USB_SW_N  (via drill 0.3)
  Top 0.178: IC3.8 19.45,10.9 18.83,11.52 16.18,11.52 v16.18,11.3 | TP3.TP 28.29,44.19 JP1.5
  Bottom 0.178: v16.18,11.3 16.18,11.52 15.6,11.52 15.6,36.64 19.93,40.97 28.65,40.97 29.31,41.64 29.31,42.33 28.25,43.39 JP1.5
USB_SW_P  (via drill 0.3)
  Top 0.178: IC3.9 19.95,10.87 18.96,11.85 16.18,11.85 v16.18,12.06 | TP4.TP 31.09,43.93 JP1.7
  Bottom 0.178: v16.18,12.06 16.18,11.85 15.93,11.85 15.93,36.5 20.06,40.64 28.78,40.64 29.64,41.5 29.64,42.24 30.79,43.39 JP1.7
VCC/2  (via drill 0.35)
  Top 0.152: Q1.2 25.16,12.82 25.16,11.43 23.68,9.95 R2.1
  Top 0.305: v25.16,5.08 25.16,5.92 23.68,7.41 R2.1 | v17.54,6.1 18.3,6.1 18.81,5.59 18.81,4.18 JP2.VBUS
  Bottom 0.305: JP4.3 103.27,22.23 103.27,3.17 98.18,3.17 95.59,0.59 25.75,0.59 25.16,1.18 v25.16,5.08 18.56,5.08 v17.54,6.1
  Bottom 0.406: JP4.3 101.36,30.48 JP3.1

### Text on the board
tNames: 2+3 / PROG | ONLY USE / SD WITH / CM LITE | CM3-DAUGHTERBOARD / HTTPS://NEBRA.COM / V2020-06-09-1511
bStop: The Cake Is A Lie